# EAGLE schematic MechModule (EAGLE 6.6.0)
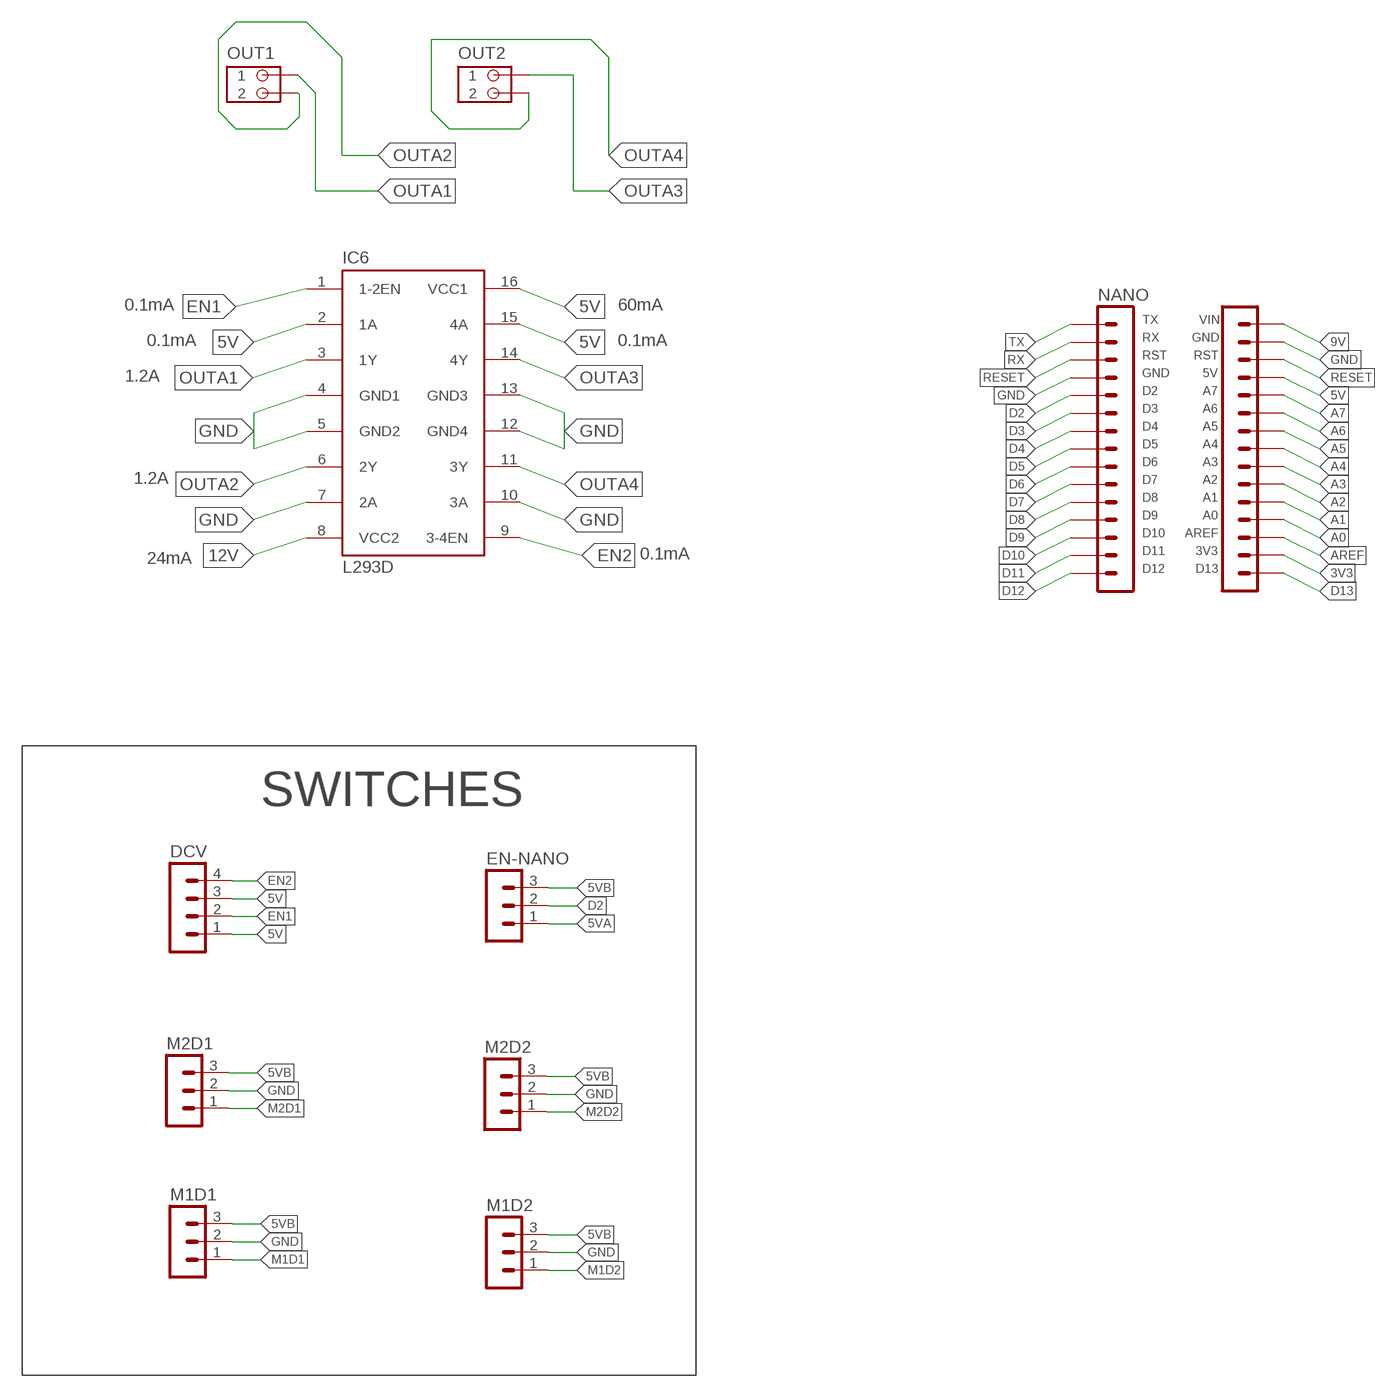
[diagram p0: schematic, sheet 1, part 1 of 3]
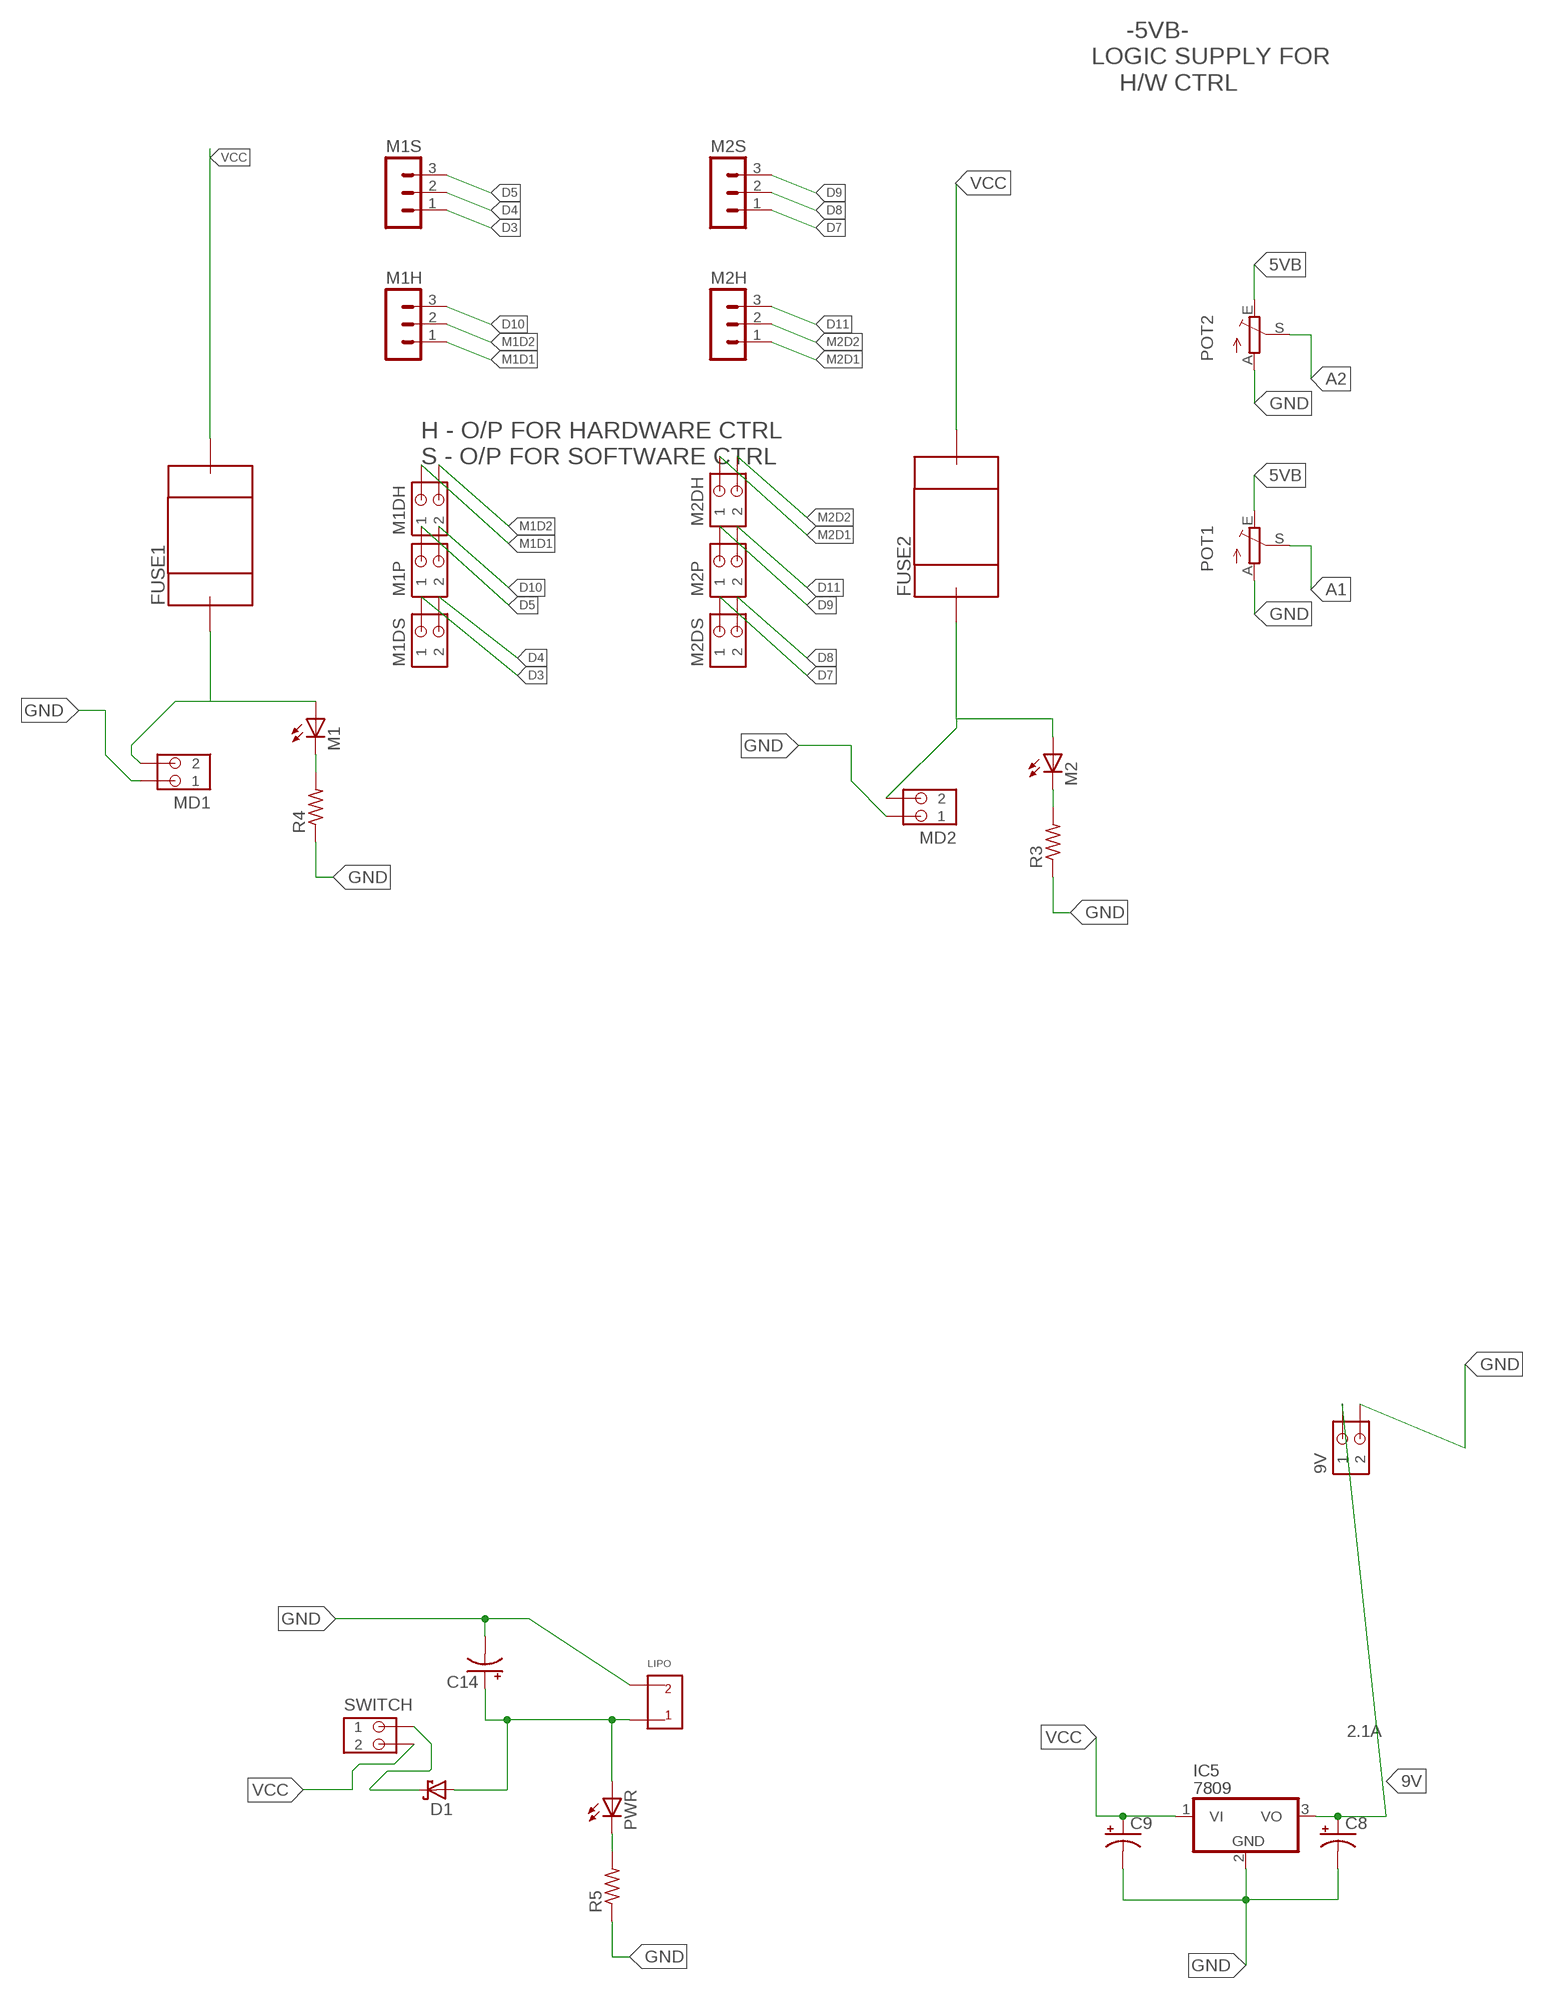
[diagram p1: schematic, sheet 1, part 2 of 3]
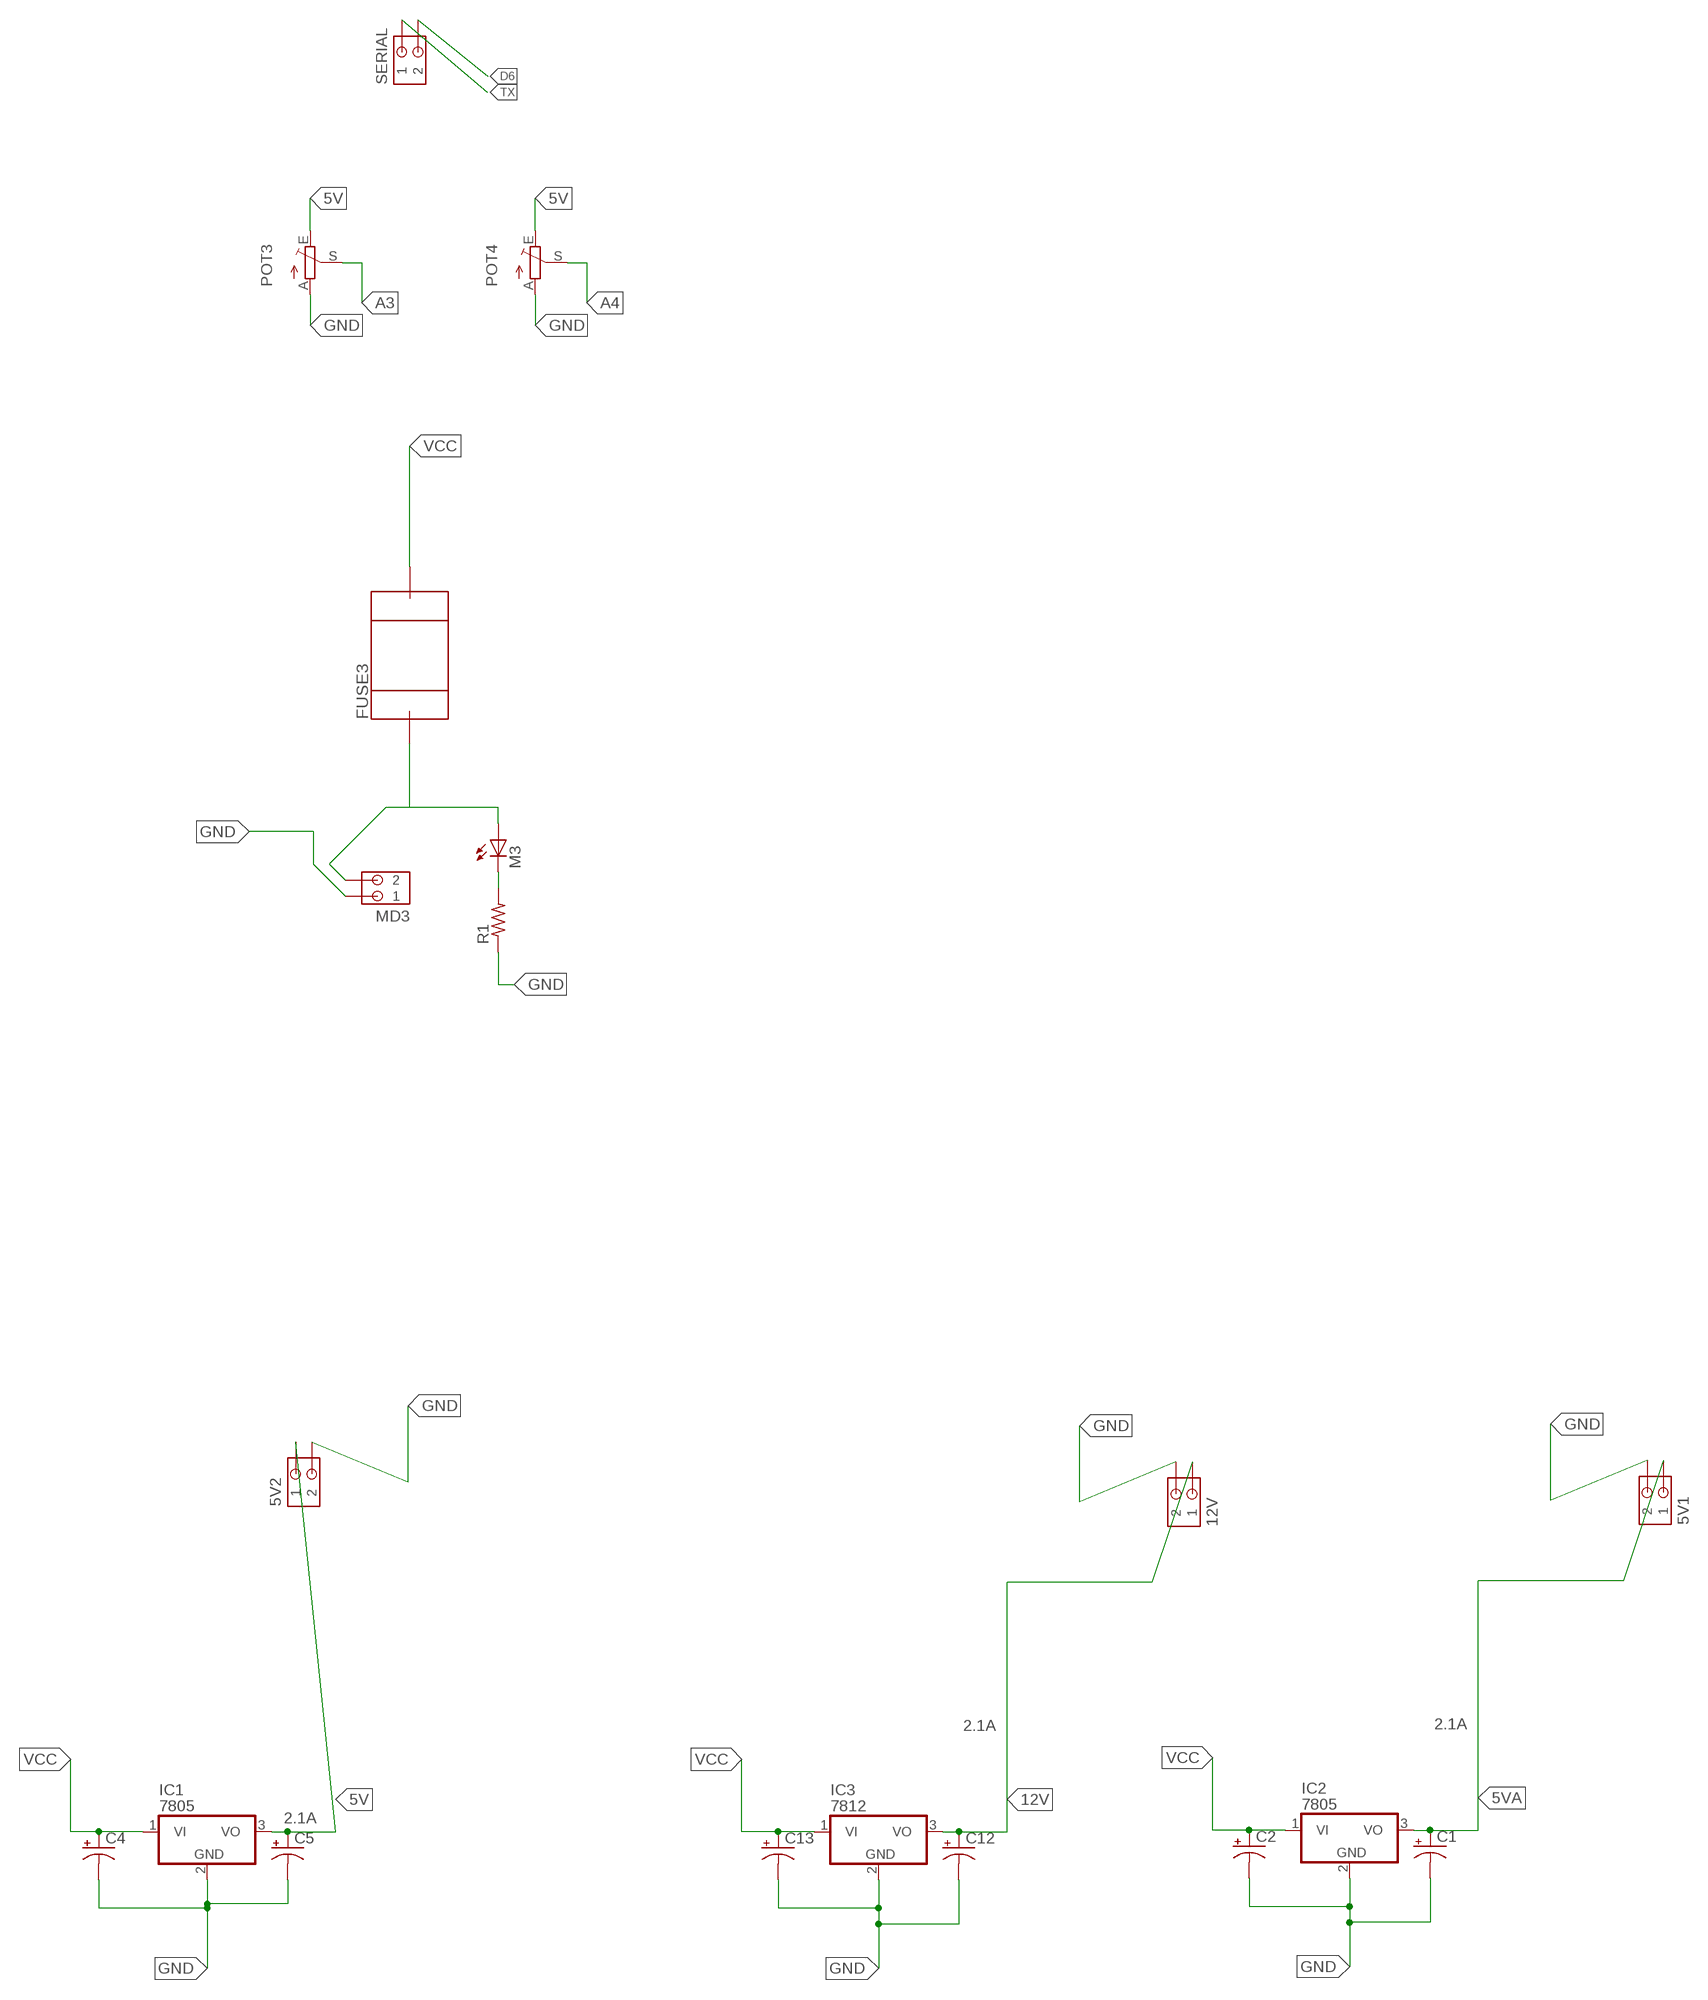
[diagram p2: schematic, sheet 1, part 3 of 3]

## Parts
5V1  SCREWCONN  [STANDARD]
5V2  SCREWCONN  [STANDARD]
9V  SCREWCONN  [STANDARD]
12V  SCREWCONN  [STANDARD]
C1  CPOL-USE2-5  [E2-5]
C2  CPOL-USE2-5  [E2-5]
C4  CPOL-USE2-5  [E2-5]
C5  CPOL-USE2-5  [E2-5]
C8  CPOL-USE2-5  [E2-5]
C9  CPOL-USE2-5  [E2-5]
C12  CPOL-USE2-5  [E2-5]
C13  CPOL-USE2-5  [E2-5]
C14  CPOL-USE7.5-16  [E7,5-16]
D1  5KPXX  [P6T15]
DCV  MA04-1  [MA04-1]
EN-NANO  MA03-1  [MA03-1]
FUSE1  CPT-FUSE  [CPT-FUSES]
FUSE2  CPT-FUSE  [CPT-FUSES]
FUSE3  CPT-FUSE  [CPT-FUSES]
IC1  7805  [78XX]
IC2  7805  [78XX]
IC3  7812  [78XX]
IC5  7809  [78XX]
IC6  L293D  [DIL16]
LIPO  SCREW_XT-60  [SCREW_XT-60]
M1  LED5MM  [LED5MM]
M1D1  MA03-1  [MA03-1]
M1D2  MA03-1  [MA03-1]
M1DH  SCREWCONN  [STANDARD]
M1DS  SCREWCONN  [STANDARD]
M1H  MA03-1  [MA03-1]
M1P  SCREWCONN  [STANDARD]
M1S  MA03-1  [MA03-1]
M2  LED5MM  [LED5MM]
M2D1  MA03-1  [MA03-1]
M2D2  MA03-1  [MA03-1]
M2DH  SCREWCONN  [STANDARD]
M2DS  SCREWCONN  [STANDARD]
M2H  MA03-1  [MA03-1]
M2P  SCREWCONN  [STANDARD]
M2S  MA03-1  [MA03-1]
M3  LED5MM  [LED5MM]
MD1  SCREWCONN  [STANDARD]
MD2  SCREWCONN  [STANDARD]
MD3  SCREWCONN  [STANDARD]
NANO  ARD-NANO  [ARD-NANO]
OUT1  SCREWCONN  [STANDARD]
OUT2  SCREWCONN  [STANDARD]
POT1  TRIM_EU-CA6V  [CA6V]
POT2  TRIM_EU-CA6V  [CA6V]
POT3  TRIM_EU-CA6V  [CA6V]
POT4  TRIM_EU-CA6V  [CA6V]
PWR  LED5MM  [LED5MM]
R1  R-US_0204/7  [0204/7]
R3  R-US_0204/7  [0204/7]
R4  R-US_0204/7  [0204/7]
R5  R-US_0204/7  [0204/7]
SERIAL  SCREWCONN  [STANDARD]
SWITCH  SCREWCONN  [STANDARD]

## Nets
3V3: NANO.3V3
5V: 5V2.3 C5.+ DCV.1 DCV.3 IC1.3(VO) IC6.2(1A) IC6.15(4A) IC6.16(VCC1) NANO.5V POT3.E POT4.E
5VA: 5V1.3 C1.+ EN-NANO.1 IC2.3(VO)
5VB: EN-NANO.3 M1D1.3 M1D2.3 M2D1.3 M2D2.3 POT1.E POT2.E
9V: 9V.3 C8.+ IC5.3(VO) NANO.VIN
12V: 12V.3 C12.+ IC3.3(VO) IC6.8(VCC2)
+24: C14.+ D1.A LIPO.P$1 PWR.A
A0: NANO.A0
A1: NANO.A1 POT1.S
A2: NANO.A2 POT2.S
A3: NANO.A3 POT3.S
A4: NANO.A4 POT4.S
A5: NANO.A5
A6: NANO.A6
A7: NANO.A7
AREF: NANO.AREF
D2: EN-NANO.2 NANO.D2
D3: M1DS.3 M1S.1 NANO.D3
D4: M1DS.4 M1S.2 NANO.D4
D5: M1P.3 M1S.3 NANO.D5
D6: NANO.D6 SERIAL.4
D7: M2DS.3 M2S.1 NANO.D7
D8: M2DS.4 M2S.2 NANO.D8
D9: M2P.3 M2S.3 NANO.D9
D10: M1H.3 M1P.4 NANO.D10
D11: M2H.3 M2P.4 NANO.D11
D12: NANO.D12
D13: NANO.D13
EN1: DCV.2 IC6.1(1-2EN)
EN2: DCV.4 IC6.9(3-4EN)
FUSE1: FUSE1.P$1 M1.A MD1.4
FUSE2: FUSE2.P$1 M2.A MD2.4
FUSE3: FUSE3.P$1 M3.A MD3.4
GND: 5V1.4 5V2.4 9V.4 12V.4 C1.- C2.- C4.- C5.- C8.- C9.- C12.- C13.- C14.- IC1.2(GND) IC2.2(GND) IC3.2(GND) IC5.2(GND) IC6.4(GND1) IC6.5(GND2) IC6.7(2A) IC6.10(3A) IC6.12(GND4) IC6.13(GND3) LIPO.P$2 M1D1.2 M1D2.2 M2D1.2 M2D2.2 MD1.3 MD2.3 MD3.3 NANO.GND1 NANO.GND2 POT1.A POT2.A POT3.A POT4.A R1.1 R3.1 R4.1 R5.1
M1D1: M1D1.1 M1DH.3 M1H.1
M1D2: M1D2.1 M1DH.4 M1H.2
M2D1: M2D1.1 M2DH.3 M2H.1
M2D2: M2D2.1 M2DH.4 M2H.2
N$1: D1.C SWITCH.3
N$2: M3.K(C) R1.2
N$3: M2.K(C) R3.2
N$4: M1.K(C) R4.2
N$5: PWR.K(C) R5.2
OUTA1: IC6.3(1Y) OUT1.3
OUTA2: IC6.6(2Y) OUT1.4
OUTA3: IC6.14(4Y) OUT2.3
OUTA4: IC6.11(3Y) OUT2.4
RESET: NANO.RST1 NANO.RST2
RX: NANO.RX
TX: NANO.TX SERIAL.3
VCC: C2.+ C4.+ C9.+ C13.+ FUSE1.P$2 FUSE2.P$2 FUSE3.P$2 IC1.1(VI) IC2.1(VI) IC3.1(VI) IC5.1(VI) SWITCH.4

## Notes on the sheet
- 0.1mA | 60mA
- 0.1mA | 0.1mA
- 1.2A
- 1.2A
- 24mA | 0.1mA
- SWITCHES
- -5VB-
  LOGIC SUPPLY FOR
      H/W CTRL
- H - O/P FOR HARDWARE CTRL
  S - O/P FOR SOFTWARE CTRL
- 2.1A | 2.1A
- 2.1A
- 2.1A

## Library data of the parts
5V1 5V2 9V 12V M1DH M1DS M1P M2DH M2DS M2P MD1-MD3 OUT1 OUT2 SERIAL SWITCH = sptb:SCREWCONN
C1 C2 C4 C5 C8 C9 C12-C14 = rcl:CPOL-US: POLARIZED CAPACITOR, American symbol
D1 = diode:5KPXX: DIODE transient voltage suppressor
DCV = 00-con-lstb_edited:MA04-1
EN-NANO M1D1 M1D2 M1H M1S M2D1 M2D2 M2H M2S = 00-con-lstb_edited:MA03-1: PIN HEADER; OC_FARNELL: unknown; OC_NEWARK: unknown
FUSE1-FUSE3 = #rcn-15:CPT-FUSE
IC1-IC3 IC5 = #rcn-15:78*: Positive VOLTAGE REGULATOR Source: http://cache.national.com/ds/LM/LM78L05.pdf http://www.fairchildsemi.com/ds/LM/LM7805.pdf
IC6 = st-microelectronics:L293D: PUSH-PULL 4 CHANNEL DRIVER; MPN: L293D; OC_FARNELL: 9589619; OC_NEWARK: 56P8249
LIPO = #rcn-15:SCREW_XT-60
M1-M3 PWR = led:LED: LED OSRAM: - CHIPLED LG R971, LG N971, LY N971, LG Q971, LY Q971, LO R971, LY R971 LH N974, LH R974 LS Q976, LO Q976, LY Q976 LO Q996 - Hyper CHIPLED LW Q18S LB Q993, LB Q99A, LB R99A - SideLED LS A670, LO A670, LY A670, LG A670, LP A670 LB A673, LV A673, LT A673, LW A673 LH A674 LY A675 LS A676, LA A676, LO A676, LY A676, LW A676 LS A679, LY A679, LG A679 - Hyper Micro SIDELED® LS Y876, LA Y876, LO Y876, LY Y876 LT Y87S - SmartLED LW L88C, LW L88S LB L89C, LB L89S, LG L890 LS L89K, LO L89K, LY L89K LS L896, LA L896, LO L896, LY L896 - TOPLED LS T670, LO T670, LY T670, LG T670, LP T670 LSG T670, LSP T670, LSY T670, LOP T670, LYG T670 LG T671, LOG T671, LSG T671 LB T673, LV T673, LT T673, LW T673 LH T674 LS T676, LA T676, LO T676, LY T676, LB T676, LH T676, LSB T676, LW T676 LB T67C, LV T67C, LT T67C, LS T67K, LO T67K, LY T67K, LW E67C LS E67B, LA E67B, LO E67B, LY E67B, LB E67C, LV E67C, LT E67C LW T67C LS T679, LY T679, LG T679 LS T770, LO T770, LY T770, LG T770, LP T770 LB T773, LV T773, LT T773, LW T773 LH T774 LS E675, LA E675, LY E675, LS T675 LS T776, LA T776, LO T776, LY T776, LB T776 LHGB T686 LT T68C, LB T68C - Hyper Mini TOPLED® LB M676 - Mini TOPLED Santana® LG M470 LS M47K, LO M47K, LY M47K Source: http://www.osram.convergy.de LUXEON: - LUMILED® LXK2-PW12-R00, LXK2-PW12-S00, LXK2-PW14-U00, LXK2-PW14-V00 LXK2-PM12-R00, LXK2-PM12-S00, LXK2-PM14-U00 LXK2-PE12-Q00, LXK2-PE12-R00, LXK2-PE12-S00, LXK2-PE14-T00, LXK2-PE14-U00 LXK2-PB12-K00, LXK2-PB12-L00, LXK2-PB12-M00, LXK2-PB14-N00, LXK2-PB14-P00, LXK2-PB14-Q00 LXK2-PR12-L00, LXK2-PR12-M00, LXK2-PR14-Q00, LXK2-PR14-R00 LXK2-PD12-Q00, LXK2-PD12-R00, LXK2-PD12-S00 LXK2-PH12-R00, LXK2-PH12-S00 LXK2-PL12-P00, LXK2-PL12-Q00, LXK2-PL12-R00 Source: www.luxeon.com KINGBRIGHT: KA-3528ASYC Source: www.kingbright.com
NANO = #rcn-15:ARD-NANO
POT1-POT4 = pot:TRIM_EU-: POTENTIOMETER
R1 R3-R5 = rcl:R-US_: RESISTOR, American symbol

## Net classes
1 24V|GND: width 5.08 mm, drill 0.61 mm, clearance 0.381 mm